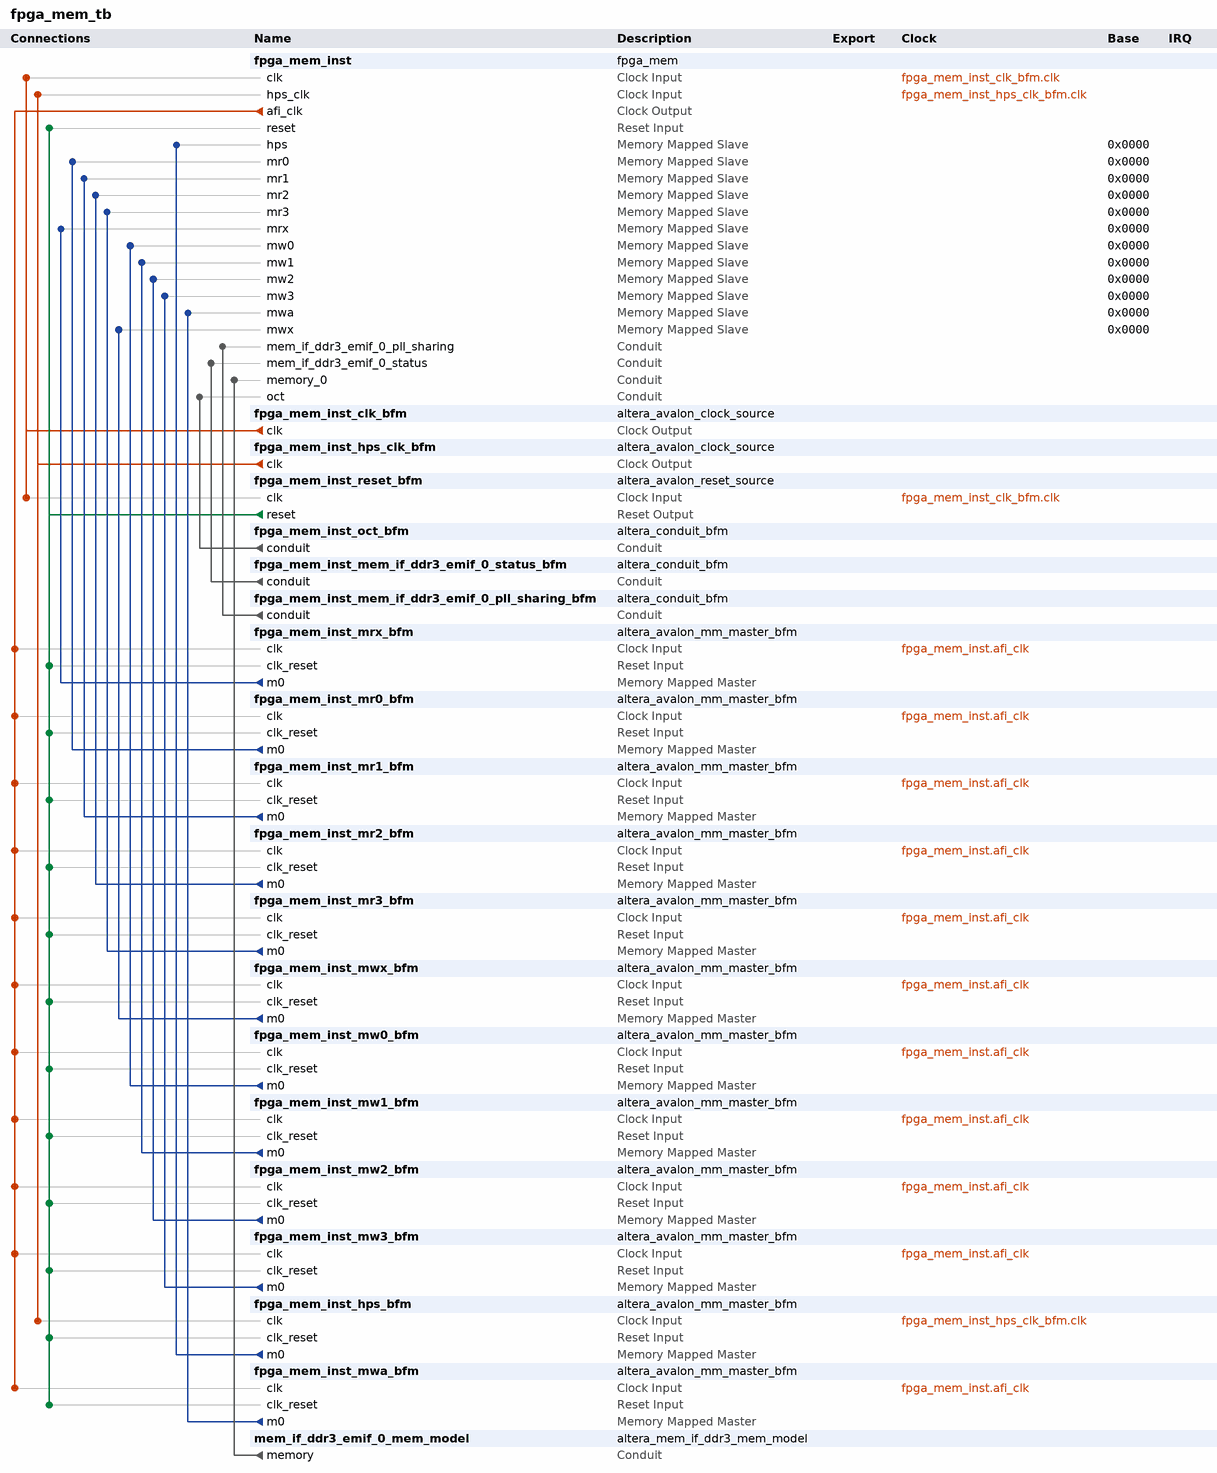
[diagram p0: system contents]
# Platform Designer (Qsys) system fpga_mem_tb, Cyclone V 5CSXFC6D6F31C6
# Parameters at their usual value, and those the tool derives, are not listed.
package require -exact qsys 13.1
create_system fpga_mem_tb
set_project_property DEVICE_FAMILY {Cyclone V}
set_project_property DEVICE 5CSXFC6D6F31C6

add_instance fpga_mem_inst fpga_mem 1.0

add_instance fpga_mem_inst_clk_bfm altera_avalon_clock_source 13.1

add_instance fpga_mem_inst_hps_clk_bfm altera_avalon_clock_source 13.1

add_instance fpga_mem_inst_reset_bfm altera_avalon_reset_source 13.1
set_instance_parameter_value fpga_mem_inst_reset_bfm ASSERT_HIGH_RESET 0
set_instance_parameter_value fpga_mem_inst_reset_bfm INITIAL_RESET_CYCLES 50

add_instance fpga_mem_inst_oct_bfm altera_conduit_bfm 13.1
set_instance_parameter_value fpga_mem_inst_oct_bfm CLOCKED_SIGNAL false
set_instance_parameter_value fpga_mem_inst_oct_bfm ENABLE_RESET false
set_instance_parameter_value fpga_mem_inst_oct_bfm SIGNAL_ROLES rzqin
set_instance_parameter_value fpga_mem_inst_oct_bfm SIGNAL_WIDTHS 1
set_instance_parameter_value fpga_mem_inst_oct_bfm SIGNAL_DIRECTIONS output

add_instance fpga_mem_inst_mem_if_ddr3_emif_0_status_bfm altera_conduit_bfm 13.1
set_instance_parameter_value fpga_mem_inst_mem_if_ddr3_emif_0_status_bfm CLOCKED_SIGNAL false
set_instance_parameter_value fpga_mem_inst_mem_if_ddr3_emif_0_status_bfm ENABLE_RESET false
set_instance_parameter_value fpga_mem_inst_mem_if_ddr3_emif_0_status_bfm SIGNAL_ROLES local_init_done,local_cal_success,local_cal_fail
set_instance_parameter_value fpga_mem_inst_mem_if_ddr3_emif_0_status_bfm SIGNAL_WIDTHS 1,1,1
set_instance_parameter_value fpga_mem_inst_mem_if_ddr3_emif_0_status_bfm SIGNAL_DIRECTIONS input,input,input

add_instance fpga_mem_inst_mem_if_ddr3_emif_0_pll_sharing_bfm altera_conduit_bfm 13.1
set_instance_parameter_value fpga_mem_inst_mem_if_ddr3_emif_0_pll_sharing_bfm CLOCKED_SIGNAL false
set_instance_parameter_value fpga_mem_inst_mem_if_ddr3_emif_0_pll_sharing_bfm ENABLE_RESET false
set_instance_parameter_value fpga_mem_inst_mem_if_ddr3_emif_0_pll_sharing_bfm SIGNAL_ROLES pll_mem_clk,pll_write_clk,pll_locked,pll_write_clk_pre_phy_clk,pll_addr_cmd_clk,pll_avl_clk,pll_config_clk,pll_dr_clk,pll_dr_clk_pre_phy_clk,pll_mem_phy_clk,afi_phy_clk,pll_avl_phy_clk
set_instance_parameter_value fpga_mem_inst_mem_if_ddr3_emif_0_pll_sharing_bfm SIGNAL_WIDTHS 1,1,1,1,1,1,1,1,1,1,1,1
set_instance_parameter_value fpga_mem_inst_mem_if_ddr3_emif_0_pll_sharing_bfm SIGNAL_DIRECTIONS input,input,input,input,input,input,input,input,input,input,input,input

add_instance fpga_mem_inst_mrx_bfm altera_avalon_mm_master_bfm 13.1
set_instance_parameter_value fpga_mem_inst_mrx_bfm AV_ADDRESS_W 26
set_instance_parameter_value fpga_mem_inst_mrx_bfm AV_NUMSYMBOLS 16
set_instance_parameter_value fpga_mem_inst_mrx_bfm AV_BURSTCOUNT_W 6
set_instance_parameter_value fpga_mem_inst_mrx_bfm AV_READRESPONSE_W 1
set_instance_parameter_value fpga_mem_inst_mrx_bfm AV_WRITERESPONSE_W 1
set_instance_parameter_value fpga_mem_inst_mrx_bfm USE_READ 1
set_instance_parameter_value fpga_mem_inst_mrx_bfm USE_BYTE_ENABLE 1
set_instance_parameter_value fpga_mem_inst_mrx_bfm USE_BURSTCOUNT 1
set_instance_parameter_value fpga_mem_inst_mrx_bfm USE_READ_DATA 1
set_instance_parameter_value fpga_mem_inst_mrx_bfm USE_READ_DATA_VALID 1
set_instance_parameter_value fpga_mem_inst_mrx_bfm USE_DEBUGACCESS 1
set_instance_parameter_value fpga_mem_inst_mrx_bfm USE_WAIT_REQUEST 1
set_instance_parameter_value fpga_mem_inst_mrx_bfm AV_CONSTANT_BURST_BEHAVIOR 1
set_instance_parameter_value fpga_mem_inst_mrx_bfm AV_BURST_LINEWRAP 0
set_instance_parameter_value fpga_mem_inst_mrx_bfm AV_BURST_BNDR_ONLY 0
set_instance_parameter_value fpga_mem_inst_mrx_bfm AV_MAX_PENDING_READS 4
set_instance_parameter_value fpga_mem_inst_mrx_bfm AV_MAX_PENDING_WRITES 0
set_instance_parameter_value fpga_mem_inst_mrx_bfm AV_FIX_READ_LATENCY 0
set_instance_parameter_value fpga_mem_inst_mrx_bfm AV_READ_WAIT_TIME 0
set_instance_parameter_value fpga_mem_inst_mrx_bfm ADDRESS_UNITS WORDS
set_instance_parameter_value fpga_mem_inst_mrx_bfm VHDL_ID 0

add_instance fpga_mem_inst_mr0_bfm altera_avalon_mm_master_bfm 13.1
set_instance_parameter_value fpga_mem_inst_mr0_bfm AV_ADDRESS_W 26
set_instance_parameter_value fpga_mem_inst_mr0_bfm AV_NUMSYMBOLS 16
set_instance_parameter_value fpga_mem_inst_mr0_bfm AV_BURSTCOUNT_W 6
set_instance_parameter_value fpga_mem_inst_mr0_bfm AV_READRESPONSE_W 1
set_instance_parameter_value fpga_mem_inst_mr0_bfm AV_WRITERESPONSE_W 1
set_instance_parameter_value fpga_mem_inst_mr0_bfm USE_READ 1
set_instance_parameter_value fpga_mem_inst_mr0_bfm USE_BYTE_ENABLE 1
set_instance_parameter_value fpga_mem_inst_mr0_bfm USE_BURSTCOUNT 1
set_instance_parameter_value fpga_mem_inst_mr0_bfm USE_READ_DATA 1
set_instance_parameter_value fpga_mem_inst_mr0_bfm USE_READ_DATA_VALID 1
set_instance_parameter_value fpga_mem_inst_mr0_bfm USE_DEBUGACCESS 1
set_instance_parameter_value fpga_mem_inst_mr0_bfm USE_WAIT_REQUEST 1
set_instance_parameter_value fpga_mem_inst_mr0_bfm AV_CONSTANT_BURST_BEHAVIOR 1
set_instance_parameter_value fpga_mem_inst_mr0_bfm AV_BURST_LINEWRAP 0
set_instance_parameter_value fpga_mem_inst_mr0_bfm AV_BURST_BNDR_ONLY 0
set_instance_parameter_value fpga_mem_inst_mr0_bfm AV_MAX_PENDING_READS 4
set_instance_parameter_value fpga_mem_inst_mr0_bfm AV_MAX_PENDING_WRITES 0
set_instance_parameter_value fpga_mem_inst_mr0_bfm AV_FIX_READ_LATENCY 0
set_instance_parameter_value fpga_mem_inst_mr0_bfm AV_READ_WAIT_TIME 0
set_instance_parameter_value fpga_mem_inst_mr0_bfm ADDRESS_UNITS WORDS
set_instance_parameter_value fpga_mem_inst_mr0_bfm VHDL_ID 1

add_instance fpga_mem_inst_mr1_bfm altera_avalon_mm_master_bfm 13.1
set_instance_parameter_value fpga_mem_inst_mr1_bfm AV_ADDRESS_W 26
set_instance_parameter_value fpga_mem_inst_mr1_bfm AV_NUMSYMBOLS 16
set_instance_parameter_value fpga_mem_inst_mr1_bfm AV_BURSTCOUNT_W 6
set_instance_parameter_value fpga_mem_inst_mr1_bfm AV_READRESPONSE_W 1
set_instance_parameter_value fpga_mem_inst_mr1_bfm AV_WRITERESPONSE_W 1
set_instance_parameter_value fpga_mem_inst_mr1_bfm USE_READ 1
set_instance_parameter_value fpga_mem_inst_mr1_bfm USE_BYTE_ENABLE 1
set_instance_parameter_value fpga_mem_inst_mr1_bfm USE_BURSTCOUNT 1
set_instance_parameter_value fpga_mem_inst_mr1_bfm USE_READ_DATA 1
set_instance_parameter_value fpga_mem_inst_mr1_bfm USE_READ_DATA_VALID 1
set_instance_parameter_value fpga_mem_inst_mr1_bfm USE_DEBUGACCESS 1
set_instance_parameter_value fpga_mem_inst_mr1_bfm USE_WAIT_REQUEST 1
set_instance_parameter_value fpga_mem_inst_mr1_bfm AV_CONSTANT_BURST_BEHAVIOR 1
set_instance_parameter_value fpga_mem_inst_mr1_bfm AV_BURST_LINEWRAP 0
set_instance_parameter_value fpga_mem_inst_mr1_bfm AV_BURST_BNDR_ONLY 0
set_instance_parameter_value fpga_mem_inst_mr1_bfm AV_MAX_PENDING_READS 4
set_instance_parameter_value fpga_mem_inst_mr1_bfm AV_MAX_PENDING_WRITES 0
set_instance_parameter_value fpga_mem_inst_mr1_bfm AV_FIX_READ_LATENCY 0
set_instance_parameter_value fpga_mem_inst_mr1_bfm AV_READ_WAIT_TIME 0
set_instance_parameter_value fpga_mem_inst_mr1_bfm ADDRESS_UNITS WORDS
set_instance_parameter_value fpga_mem_inst_mr1_bfm VHDL_ID 2

add_instance fpga_mem_inst_mr2_bfm altera_avalon_mm_master_bfm 13.1
set_instance_parameter_value fpga_mem_inst_mr2_bfm AV_ADDRESS_W 26
set_instance_parameter_value fpga_mem_inst_mr2_bfm AV_NUMSYMBOLS 16
set_instance_parameter_value fpga_mem_inst_mr2_bfm AV_BURSTCOUNT_W 6
set_instance_parameter_value fpga_mem_inst_mr2_bfm AV_READRESPONSE_W 1
set_instance_parameter_value fpga_mem_inst_mr2_bfm AV_WRITERESPONSE_W 1
set_instance_parameter_value fpga_mem_inst_mr2_bfm USE_READ 1
set_instance_parameter_value fpga_mem_inst_mr2_bfm USE_BYTE_ENABLE 1
set_instance_parameter_value fpga_mem_inst_mr2_bfm USE_BURSTCOUNT 1
set_instance_parameter_value fpga_mem_inst_mr2_bfm USE_READ_DATA 1
set_instance_parameter_value fpga_mem_inst_mr2_bfm USE_READ_DATA_VALID 1
set_instance_parameter_value fpga_mem_inst_mr2_bfm USE_DEBUGACCESS 1
set_instance_parameter_value fpga_mem_inst_mr2_bfm USE_WAIT_REQUEST 1
set_instance_parameter_value fpga_mem_inst_mr2_bfm AV_CONSTANT_BURST_BEHAVIOR 1
set_instance_parameter_value fpga_mem_inst_mr2_bfm AV_BURST_LINEWRAP 0
set_instance_parameter_value fpga_mem_inst_mr2_bfm AV_BURST_BNDR_ONLY 0
set_instance_parameter_value fpga_mem_inst_mr2_bfm AV_MAX_PENDING_READS 4
set_instance_parameter_value fpga_mem_inst_mr2_bfm AV_MAX_PENDING_WRITES 0
set_instance_parameter_value fpga_mem_inst_mr2_bfm AV_FIX_READ_LATENCY 0
set_instance_parameter_value fpga_mem_inst_mr2_bfm AV_READ_WAIT_TIME 0
set_instance_parameter_value fpga_mem_inst_mr2_bfm ADDRESS_UNITS WORDS
set_instance_parameter_value fpga_mem_inst_mr2_bfm VHDL_ID 3

add_instance fpga_mem_inst_mr3_bfm altera_avalon_mm_master_bfm 13.1
set_instance_parameter_value fpga_mem_inst_mr3_bfm AV_ADDRESS_W 26
set_instance_parameter_value fpga_mem_inst_mr3_bfm AV_NUMSYMBOLS 16
set_instance_parameter_value fpga_mem_inst_mr3_bfm AV_BURSTCOUNT_W 6
set_instance_parameter_value fpga_mem_inst_mr3_bfm AV_READRESPONSE_W 1
set_instance_parameter_value fpga_mem_inst_mr3_bfm AV_WRITERESPONSE_W 1
set_instance_parameter_value fpga_mem_inst_mr3_bfm USE_READ 1
set_instance_parameter_value fpga_mem_inst_mr3_bfm USE_BYTE_ENABLE 1
set_instance_parameter_value fpga_mem_inst_mr3_bfm USE_BURSTCOUNT 1
set_instance_parameter_value fpga_mem_inst_mr3_bfm USE_READ_DATA 1
set_instance_parameter_value fpga_mem_inst_mr3_bfm USE_READ_DATA_VALID 1
set_instance_parameter_value fpga_mem_inst_mr3_bfm USE_DEBUGACCESS 1
set_instance_parameter_value fpga_mem_inst_mr3_bfm USE_WAIT_REQUEST 1
set_instance_parameter_value fpga_mem_inst_mr3_bfm AV_CONSTANT_BURST_BEHAVIOR 1
set_instance_parameter_value fpga_mem_inst_mr3_bfm AV_BURST_LINEWRAP 0
set_instance_parameter_value fpga_mem_inst_mr3_bfm AV_BURST_BNDR_ONLY 0
set_instance_parameter_value fpga_mem_inst_mr3_bfm AV_MAX_PENDING_READS 4
set_instance_parameter_value fpga_mem_inst_mr3_bfm AV_MAX_PENDING_WRITES 0
set_instance_parameter_value fpga_mem_inst_mr3_bfm AV_FIX_READ_LATENCY 0
set_instance_parameter_value fpga_mem_inst_mr3_bfm AV_READ_WAIT_TIME 0
set_instance_parameter_value fpga_mem_inst_mr3_bfm ADDRESS_UNITS WORDS
set_instance_parameter_value fpga_mem_inst_mr3_bfm VHDL_ID 4

add_instance fpga_mem_inst_mwx_bfm altera_avalon_mm_master_bfm 13.1
set_instance_parameter_value fpga_mem_inst_mwx_bfm AV_ADDRESS_W 26
set_instance_parameter_value fpga_mem_inst_mwx_bfm AV_NUMSYMBOLS 16
set_instance_parameter_value fpga_mem_inst_mwx_bfm AV_BURSTCOUNT_W 6
set_instance_parameter_value fpga_mem_inst_mwx_bfm AV_READRESPONSE_W 1
set_instance_parameter_value fpga_mem_inst_mwx_bfm AV_WRITERESPONSE_W 1
set_instance_parameter_value fpga_mem_inst_mwx_bfm USE_READ 1
set_instance_parameter_value fpga_mem_inst_mwx_bfm USE_BYTE_ENABLE 1
set_instance_parameter_value fpga_mem_inst_mwx_bfm USE_BURSTCOUNT 1
set_instance_parameter_value fpga_mem_inst_mwx_bfm USE_READ_DATA 1
set_instance_parameter_value fpga_mem_inst_mwx_bfm USE_READ_DATA_VALID 1
set_instance_parameter_value fpga_mem_inst_mwx_bfm USE_DEBUGACCESS 1
set_instance_parameter_value fpga_mem_inst_mwx_bfm USE_WAIT_REQUEST 1
set_instance_parameter_value fpga_mem_inst_mwx_bfm AV_CONSTANT_BURST_BEHAVIOR 1
set_instance_parameter_value fpga_mem_inst_mwx_bfm AV_BURST_LINEWRAP 0
set_instance_parameter_value fpga_mem_inst_mwx_bfm AV_BURST_BNDR_ONLY 0
set_instance_parameter_value fpga_mem_inst_mwx_bfm AV_MAX_PENDING_READS 4
set_instance_parameter_value fpga_mem_inst_mwx_bfm AV_MAX_PENDING_WRITES 0
set_instance_parameter_value fpga_mem_inst_mwx_bfm AV_FIX_READ_LATENCY 0
set_instance_parameter_value fpga_mem_inst_mwx_bfm AV_READ_WAIT_TIME 0
set_instance_parameter_value fpga_mem_inst_mwx_bfm ADDRESS_UNITS WORDS
set_instance_parameter_value fpga_mem_inst_mwx_bfm VHDL_ID 5

add_instance fpga_mem_inst_mw0_bfm altera_avalon_mm_master_bfm 13.1
set_instance_parameter_value fpga_mem_inst_mw0_bfm AV_ADDRESS_W 26
set_instance_parameter_value fpga_mem_inst_mw0_bfm AV_NUMSYMBOLS 16
set_instance_parameter_value fpga_mem_inst_mw0_bfm AV_BURSTCOUNT_W 6
set_instance_parameter_value fpga_mem_inst_mw0_bfm AV_READRESPONSE_W 1
set_instance_parameter_value fpga_mem_inst_mw0_bfm AV_WRITERESPONSE_W 1
set_instance_parameter_value fpga_mem_inst_mw0_bfm USE_READ 1
set_instance_parameter_value fpga_mem_inst_mw0_bfm USE_BYTE_ENABLE 1
set_instance_parameter_value fpga_mem_inst_mw0_bfm USE_BURSTCOUNT 1
set_instance_parameter_value fpga_mem_inst_mw0_bfm USE_READ_DATA 1
set_instance_parameter_value fpga_mem_inst_mw0_bfm USE_READ_DATA_VALID 1
set_instance_parameter_value fpga_mem_inst_mw0_bfm USE_DEBUGACCESS 1
set_instance_parameter_value fpga_mem_inst_mw0_bfm USE_WAIT_REQUEST 1
set_instance_parameter_value fpga_mem_inst_mw0_bfm AV_CONSTANT_BURST_BEHAVIOR 1
set_instance_parameter_value fpga_mem_inst_mw0_bfm AV_BURST_LINEWRAP 0
set_instance_parameter_value fpga_mem_inst_mw0_bfm AV_BURST_BNDR_ONLY 0
set_instance_parameter_value fpga_mem_inst_mw0_bfm AV_MAX_PENDING_READS 4
set_instance_parameter_value fpga_mem_inst_mw0_bfm AV_MAX_PENDING_WRITES 0
set_instance_parameter_value fpga_mem_inst_mw0_bfm AV_FIX_READ_LATENCY 0
set_instance_parameter_value fpga_mem_inst_mw0_bfm AV_READ_WAIT_TIME 0
set_instance_parameter_value fpga_mem_inst_mw0_bfm ADDRESS_UNITS WORDS
set_instance_parameter_value fpga_mem_inst_mw0_bfm VHDL_ID 6

add_instance fpga_mem_inst_mw1_bfm altera_avalon_mm_master_bfm 13.1
set_instance_parameter_value fpga_mem_inst_mw1_bfm AV_ADDRESS_W 26
set_instance_parameter_value fpga_mem_inst_mw1_bfm AV_NUMSYMBOLS 16
set_instance_parameter_value fpga_mem_inst_mw1_bfm AV_BURSTCOUNT_W 6
set_instance_parameter_value fpga_mem_inst_mw1_bfm AV_READRESPONSE_W 1
set_instance_parameter_value fpga_mem_inst_mw1_bfm AV_WRITERESPONSE_W 1
set_instance_parameter_value fpga_mem_inst_mw1_bfm USE_READ 1
set_instance_parameter_value fpga_mem_inst_mw1_bfm USE_BYTE_ENABLE 1
set_instance_parameter_value fpga_mem_inst_mw1_bfm USE_BURSTCOUNT 1
set_instance_parameter_value fpga_mem_inst_mw1_bfm USE_READ_DATA 1
set_instance_parameter_value fpga_mem_inst_mw1_bfm USE_READ_DATA_VALID 1
set_instance_parameter_value fpga_mem_inst_mw1_bfm USE_DEBUGACCESS 1
set_instance_parameter_value fpga_mem_inst_mw1_bfm USE_WAIT_REQUEST 1
set_instance_parameter_value fpga_mem_inst_mw1_bfm AV_CONSTANT_BURST_BEHAVIOR 1
set_instance_parameter_value fpga_mem_inst_mw1_bfm AV_BURST_LINEWRAP 0
set_instance_parameter_value fpga_mem_inst_mw1_bfm AV_BURST_BNDR_ONLY 0
set_instance_parameter_value fpga_mem_inst_mw1_bfm AV_MAX_PENDING_READS 4
set_instance_parameter_value fpga_mem_inst_mw1_bfm AV_MAX_PENDING_WRITES 0
set_instance_parameter_value fpga_mem_inst_mw1_bfm AV_FIX_READ_LATENCY 0
set_instance_parameter_value fpga_mem_inst_mw1_bfm AV_READ_WAIT_TIME 0
set_instance_parameter_value fpga_mem_inst_mw1_bfm ADDRESS_UNITS WORDS
set_instance_parameter_value fpga_mem_inst_mw1_bfm VHDL_ID 7

add_instance fpga_mem_inst_mw2_bfm altera_avalon_mm_master_bfm 13.1
set_instance_parameter_value fpga_mem_inst_mw2_bfm AV_ADDRESS_W 26
set_instance_parameter_value fpga_mem_inst_mw2_bfm AV_NUMSYMBOLS 16
set_instance_parameter_value fpga_mem_inst_mw2_bfm AV_BURSTCOUNT_W 6
set_instance_parameter_value fpga_mem_inst_mw2_bfm AV_READRESPONSE_W 1
set_instance_parameter_value fpga_mem_inst_mw2_bfm AV_WRITERESPONSE_W 1
set_instance_parameter_value fpga_mem_inst_mw2_bfm USE_READ 1
set_instance_parameter_value fpga_mem_inst_mw2_bfm USE_BYTE_ENABLE 1
set_instance_parameter_value fpga_mem_inst_mw2_bfm USE_BURSTCOUNT 1
set_instance_parameter_value fpga_mem_inst_mw2_bfm USE_READ_DATA 1
set_instance_parameter_value fpga_mem_inst_mw2_bfm USE_READ_DATA_VALID 1
set_instance_parameter_value fpga_mem_inst_mw2_bfm USE_DEBUGACCESS 1
set_instance_parameter_value fpga_mem_inst_mw2_bfm USE_WAIT_REQUEST 1
set_instance_parameter_value fpga_mem_inst_mw2_bfm AV_CONSTANT_BURST_BEHAVIOR 1
set_instance_parameter_value fpga_mem_inst_mw2_bfm AV_BURST_LINEWRAP 0
set_instance_parameter_value fpga_mem_inst_mw2_bfm AV_BURST_BNDR_ONLY 0
set_instance_parameter_value fpga_mem_inst_mw2_bfm AV_MAX_PENDING_READS 4
set_instance_parameter_value fpga_mem_inst_mw2_bfm AV_MAX_PENDING_WRITES 0
set_instance_parameter_value fpga_mem_inst_mw2_bfm AV_FIX_READ_LATENCY 0
set_instance_parameter_value fpga_mem_inst_mw2_bfm AV_READ_WAIT_TIME 0
set_instance_parameter_value fpga_mem_inst_mw2_bfm ADDRESS_UNITS WORDS
set_instance_parameter_value fpga_mem_inst_mw2_bfm VHDL_ID 8

add_instance fpga_mem_inst_mw3_bfm altera_avalon_mm_master_bfm 13.1
set_instance_parameter_value fpga_mem_inst_mw3_bfm AV_ADDRESS_W 26
set_instance_parameter_value fpga_mem_inst_mw3_bfm AV_NUMSYMBOLS 16
set_instance_parameter_value fpga_mem_inst_mw3_bfm AV_BURSTCOUNT_W 6
set_instance_parameter_value fpga_mem_inst_mw3_bfm AV_READRESPONSE_W 1
set_instance_parameter_value fpga_mem_inst_mw3_bfm AV_WRITERESPONSE_W 1
set_instance_parameter_value fpga_mem_inst_mw3_bfm USE_READ 1
set_instance_parameter_value fpga_mem_inst_mw3_bfm USE_BYTE_ENABLE 1
set_instance_parameter_value fpga_mem_inst_mw3_bfm USE_BURSTCOUNT 1
set_instance_parameter_value fpga_mem_inst_mw3_bfm USE_READ_DATA 1
set_instance_parameter_value fpga_mem_inst_mw3_bfm USE_READ_DATA_VALID 1
set_instance_parameter_value fpga_mem_inst_mw3_bfm USE_DEBUGACCESS 1
set_instance_parameter_value fpga_mem_inst_mw3_bfm USE_WAIT_REQUEST 1
set_instance_parameter_value fpga_mem_inst_mw3_bfm AV_CONSTANT_BURST_BEHAVIOR 1
set_instance_parameter_value fpga_mem_inst_mw3_bfm AV_BURST_LINEWRAP 0
set_instance_parameter_value fpga_mem_inst_mw3_bfm AV_BURST_BNDR_ONLY 0
set_instance_parameter_value fpga_mem_inst_mw3_bfm AV_MAX_PENDING_READS 4
set_instance_parameter_value fpga_mem_inst_mw3_bfm AV_MAX_PENDING_WRITES 0
set_instance_parameter_value fpga_mem_inst_mw3_bfm AV_FIX_READ_LATENCY 0
set_instance_parameter_value fpga_mem_inst_mw3_bfm AV_READ_WAIT_TIME 0
set_instance_parameter_value fpga_mem_inst_mw3_bfm ADDRESS_UNITS WORDS
set_instance_parameter_value fpga_mem_inst_mw3_bfm VHDL_ID 9

add_instance fpga_mem_inst_hps_bfm altera_avalon_mm_master_bfm 13.1
set_instance_parameter_value fpga_mem_inst_hps_bfm AV_ADDRESS_W 26
set_instance_parameter_value fpga_mem_inst_hps_bfm AV_NUMSYMBOLS 16
set_instance_parameter_value fpga_mem_inst_hps_bfm AV_BURSTCOUNT_W 6
set_instance_parameter_value fpga_mem_inst_hps_bfm AV_READRESPONSE_W 1
set_instance_parameter_value fpga_mem_inst_hps_bfm AV_WRITERESPONSE_W 1
set_instance_parameter_value fpga_mem_inst_hps_bfm USE_READ 1
set_instance_parameter_value fpga_mem_inst_hps_bfm USE_BYTE_ENABLE 1
set_instance_parameter_value fpga_mem_inst_hps_bfm USE_BURSTCOUNT 1
set_instance_parameter_value fpga_mem_inst_hps_bfm USE_READ_DATA 1
set_instance_parameter_value fpga_mem_inst_hps_bfm USE_READ_DATA_VALID 1
set_instance_parameter_value fpga_mem_inst_hps_bfm USE_DEBUGACCESS 1
set_instance_parameter_value fpga_mem_inst_hps_bfm USE_WAIT_REQUEST 1
set_instance_parameter_value fpga_mem_inst_hps_bfm AV_CONSTANT_BURST_BEHAVIOR 1
set_instance_parameter_value fpga_mem_inst_hps_bfm AV_BURST_LINEWRAP 0
set_instance_parameter_value fpga_mem_inst_hps_bfm AV_BURST_BNDR_ONLY 0
set_instance_parameter_value fpga_mem_inst_hps_bfm AV_MAX_PENDING_READS 4
set_instance_parameter_value fpga_mem_inst_hps_bfm AV_MAX_PENDING_WRITES 0
set_instance_parameter_value fpga_mem_inst_hps_bfm AV_FIX_READ_LATENCY 0
set_instance_parameter_value fpga_mem_inst_hps_bfm AV_READ_WAIT_TIME 0
set_instance_parameter_value fpga_mem_inst_hps_bfm ADDRESS_UNITS WORDS
set_instance_parameter_value fpga_mem_inst_hps_bfm VHDL_ID 10

add_instance fpga_mem_inst_mwa_bfm altera_avalon_mm_master_bfm 13.1
set_instance_parameter_value fpga_mem_inst_mwa_bfm AV_ADDRESS_W 26
set_instance_parameter_value fpga_mem_inst_mwa_bfm AV_NUMSYMBOLS 16
set_instance_parameter_value fpga_mem_inst_mwa_bfm AV_BURSTCOUNT_W 6
set_instance_parameter_value fpga_mem_inst_mwa_bfm AV_READRESPONSE_W 1
set_instance_parameter_value fpga_mem_inst_mwa_bfm AV_WRITERESPONSE_W 1
set_instance_parameter_value fpga_mem_inst_mwa_bfm USE_READ 1
set_instance_parameter_value fpga_mem_inst_mwa_bfm USE_BYTE_ENABLE 1
set_instance_parameter_value fpga_mem_inst_mwa_bfm USE_BURSTCOUNT 1
set_instance_parameter_value fpga_mem_inst_mwa_bfm USE_READ_DATA 1
set_instance_parameter_value fpga_mem_inst_mwa_bfm USE_READ_DATA_VALID 1
set_instance_parameter_value fpga_mem_inst_mwa_bfm USE_DEBUGACCESS 1
set_instance_parameter_value fpga_mem_inst_mwa_bfm USE_WAIT_REQUEST 1
set_instance_parameter_value fpga_mem_inst_mwa_bfm AV_CONSTANT_BURST_BEHAVIOR 1
set_instance_parameter_value fpga_mem_inst_mwa_bfm AV_BURST_LINEWRAP 0
set_instance_parameter_value fpga_mem_inst_mwa_bfm AV_BURST_BNDR_ONLY 0
set_instance_parameter_value fpga_mem_inst_mwa_bfm AV_MAX_PENDING_READS 4
set_instance_parameter_value fpga_mem_inst_mwa_bfm AV_MAX_PENDING_WRITES 0
set_instance_parameter_value fpga_mem_inst_mwa_bfm AV_FIX_READ_LATENCY 0
set_instance_parameter_value fpga_mem_inst_mwa_bfm AV_READ_WAIT_TIME 0
set_instance_parameter_value fpga_mem_inst_mwa_bfm ADDRESS_UNITS WORDS
set_instance_parameter_value fpga_mem_inst_mwa_bfm VHDL_ID 11

add_instance mem_if_ddr3_emif_0_mem_model altera_mem_if_ddr3_mem_model 13.1
set_instance_parameter_value mem_if_ddr3_emif_0_mem_model MEM_VENDOR JEDEC
set_instance_parameter_value mem_if_ddr3_emif_0_mem_model MEM_FORMAT DISCRETE
set_instance_parameter_value mem_if_ddr3_emif_0_mem_model RDIMM_CONFIG 0000000000000000
set_instance_parameter_value mem_if_ddr3_emif_0_mem_model LRDIMM_EXTENDED_CONFIG 0x000000000000000000
set_instance_parameter_value mem_if_ddr3_emif_0_mem_model DISCRETE_FLY_BY true
set_instance_parameter_value mem_if_ddr3_emif_0_mem_model DEVICE_DEPTH 1
set_instance_parameter_value mem_if_ddr3_emif_0_mem_model MEM_MIRROR_ADDRESSING 0
set_instance_parameter_value mem_if_ddr3_emif_0_mem_model MEM_CLK_FREQ_MAX 400.0
set_instance_parameter_value mem_if_ddr3_emif_0_mem_model MEM_ROW_ADDR_WIDTH 15
set_instance_parameter_value mem_if_ddr3_emif_0_mem_model MEM_COL_ADDR_WIDTH 10
set_instance_parameter_value mem_if_ddr3_emif_0_mem_model MEM_DQ_WIDTH 32
set_instance_parameter_value mem_if_ddr3_emif_0_mem_model MEM_DQ_PER_DQS 8
set_instance_parameter_value mem_if_ddr3_emif_0_mem_model MEM_BANKADDR_WIDTH 3
set_instance_parameter_value mem_if_ddr3_emif_0_mem_model MEM_IF_DM_PINS_EN true
set_instance_parameter_value mem_if_ddr3_emif_0_mem_model MEM_IF_DQSN_EN true
set_instance_parameter_value mem_if_ddr3_emif_0_mem_model MEM_NUMBER_OF_DIMMS 1
set_instance_parameter_value mem_if_ddr3_emif_0_mem_model MEM_NUMBER_OF_RANKS_PER_DIMM 1
set_instance_parameter_value mem_if_ddr3_emif_0_mem_model MEM_NUMBER_OF_RANKS_PER_DEVICE 1
set_instance_parameter_value mem_if_ddr3_emif_0_mem_model MEM_RANK_MULTIPLICATION_FACTOR 1
set_instance_parameter_value mem_if_ddr3_emif_0_mem_model MEM_CK_WIDTH 1
set_instance_parameter_value mem_if_ddr3_emif_0_mem_model MEM_CS_WIDTH 1
set_instance_parameter_value mem_if_ddr3_emif_0_mem_model MEM_CLK_EN_WIDTH 1
set_instance_parameter_value mem_if_ddr3_emif_0_mem_model ALTMEMPHY_COMPATIBLE_MODE false
set_instance_parameter_value mem_if_ddr3_emif_0_mem_model NEXTGEN true
set_instance_parameter_value mem_if_ddr3_emif_0_mem_model MEM_IF_BOARD_BASE_DELAY 10
set_instance_parameter_value mem_if_ddr3_emif_0_mem_model MEM_IF_SIM_VALID_WINDOW 0
set_instance_parameter_value mem_if_ddr3_emif_0_mem_model MEM_GUARANTEED_WRITE_INIT false
set_instance_parameter_value mem_if_ddr3_emif_0_mem_model MEM_VERBOSE true
set_instance_parameter_value mem_if_ddr3_emif_0_mem_model PINGPONGPHY_EN false
set_instance_parameter_value mem_if_ddr3_emif_0_mem_model REFRESH_BURST_VALIDATION false
set_instance_parameter_value mem_if_ddr3_emif_0_mem_model MEM_BL OTF
set_instance_parameter_value mem_if_ddr3_emif_0_mem_model MEM_BT Sequential
set_instance_parameter_value mem_if_ddr3_emif_0_mem_model MEM_ASR Manual
set_instance_parameter_value mem_if_ddr3_emif_0_mem_model MEM_SRT Normal
set_instance_parameter_value mem_if_ddr3_emif_0_mem_model MEM_PD {DLL off}
set_instance_parameter_value mem_if_ddr3_emif_0_mem_model MEM_DRV_STR RZQ/7
set_instance_parameter_value mem_if_ddr3_emif_0_mem_model MEM_DLL_EN true
set_instance_parameter_value mem_if_ddr3_emif_0_mem_model MEM_RTT_NOM RZQ/6
set_instance_parameter_value mem_if_ddr3_emif_0_mem_model MEM_RTT_WR RZQ/4
set_instance_parameter_value mem_if_ddr3_emif_0_mem_model MEM_WTCL 5
set_instance_parameter_value mem_if_ddr3_emif_0_mem_model MEM_ATCL Disabled
set_instance_parameter_value mem_if_ddr3_emif_0_mem_model MEM_TCL 6
set_instance_parameter_value mem_if_ddr3_emif_0_mem_model MEM_AUTO_LEVELING_MODE true
set_instance_parameter_value mem_if_ddr3_emif_0_mem_model MEM_USER_LEVELING_MODE Leveling
set_instance_parameter_value mem_if_ddr3_emif_0_mem_model MEM_INIT_EN false
set_instance_parameter_value mem_if_ddr3_emif_0_mem_model DAT_DATA_WIDTH 32
set_instance_parameter_value mem_if_ddr3_emif_0_mem_model TIMING_TIS 200
set_instance_parameter_value mem_if_ddr3_emif_0_mem_model TIMING_TIH 275
set_instance_parameter_value mem_if_ddr3_emif_0_mem_model TIMING_TDS 75
set_instance_parameter_value mem_if_ddr3_emif_0_mem_model TIMING_TDH 150
set_instance_parameter_value mem_if_ddr3_emif_0_mem_model TIMING_TDQSQ 200
set_instance_parameter_value mem_if_ddr3_emif_0_mem_model TIMING_TQH 0.38
set_instance_parameter_value mem_if_ddr3_emif_0_mem_model TIMING_TDQSCK 400
set_instance_parameter_value mem_if_ddr3_emif_0_mem_model TIMING_TDQSCKDS 450
set_instance_parameter_value mem_if_ddr3_emif_0_mem_model TIMING_TDQSCKDM 900
set_instance_parameter_value mem_if_ddr3_emif_0_mem_model TIMING_TDQSCKDL 1200
set_instance_parameter_value mem_if_ddr3_emif_0_mem_model TIMING_TDQSS 0.25
set_instance_parameter_value mem_if_ddr3_emif_0_mem_model TIMING_TQSH 0.38
set_instance_parameter_value mem_if_ddr3_emif_0_mem_model TIMING_TDSH 0.2
set_instance_parameter_value mem_if_ddr3_emif_0_mem_model TIMING_TDSS 0.2
set_instance_parameter_value mem_if_ddr3_emif_0_mem_model MEM_TINIT_US 500
set_instance_parameter_value mem_if_ddr3_emif_0_mem_model MEM_TMRD_CK 4
set_instance_parameter_value mem_if_ddr3_emif_0_mem_model MEM_TRAS_NS 37.5
set_instance_parameter_value mem_if_ddr3_emif_0_mem_model MEM_TRCD_NS 15.0
set_instance_parameter_value mem_if_ddr3_emif_0_mem_model MEM_TRP_NS 15.0
set_instance_parameter_value mem_if_ddr3_emif_0_mem_model MEM_TREFI_US 7.8
set_instance_parameter_value mem_if_ddr3_emif_0_mem_model MEM_TRFC_NS 300.0
set_instance_parameter_value mem_if_ddr3_emif_0_mem_model CFG_TCCD_NS 2.5
set_instance_parameter_value mem_if_ddr3_emif_0_mem_model MEM_TWR_NS 15.0
set_instance_parameter_value mem_if_ddr3_emif_0_mem_model MEM_TWTR 4
set_instance_parameter_value mem_if_ddr3_emif_0_mem_model MEM_TFAW_NS 50.0
set_instance_parameter_value mem_if_ddr3_emif_0_mem_model MEM_TRRD_NS 13.2
set_instance_parameter_value mem_if_ddr3_emif_0_mem_model MEM_TRTP_NS 13.2
set_instance_parameter_value mem_if_ddr3_emif_0_mem_model RATE Full
set_instance_parameter_value mem_if_ddr3_emif_0_mem_model MEM_CLK_FREQ 400.0
set_instance_parameter_value mem_if_ddr3_emif_0_mem_model USE_MEM_CLK_FREQ false
set_instance_parameter_value mem_if_ddr3_emif_0_mem_model FORCE_DQS_TRACKING AUTO
set_instance_parameter_value mem_if_ddr3_emif_0_mem_model FORCE_SHADOW_REGS AUTO
set_instance_parameter_value mem_if_ddr3_emif_0_mem_model MRS_MIRROR_PING_PONG_ATSO false
set_instance_parameter_value mem_if_ddr3_emif_0_mem_model PARSE_FRIENDLY_DEVICE_FAMILY_PARAM_VALID false
set_instance_parameter_value mem_if_ddr3_emif_0_mem_model SPEED_GRADE 6
set_instance_parameter_value mem_if_ddr3_emif_0_mem_model IS_ES_DEVICE false
set_instance_parameter_value mem_if_ddr3_emif_0_mem_model DISABLE_CHILD_MESSAGING false
set_instance_parameter_value mem_if_ddr3_emif_0_mem_model HARD_EMIF true
set_instance_parameter_value mem_if_ddr3_emif_0_mem_model HHP_HPS false
set_instance_parameter_value mem_if_ddr3_emif_0_mem_model HHP_HPS_VERIFICATION false
set_instance_parameter_value mem_if_ddr3_emif_0_mem_model HHP_HPS_SIMULATION false
set_instance_parameter_value mem_if_ddr3_emif_0_mem_model HPS_PROTOCOL DEFAULT
set_instance_parameter_value mem_if_ddr3_emif_0_mem_model CUT_NEW_FAMILY_TIMING true

# connections
add_connection fpga_mem_inst.afi_clk fpga_mem_inst_mr0_bfm.clk clock
add_connection fpga_mem_inst.afi_clk fpga_mem_inst_mr1_bfm.clk clock
add_connection fpga_mem_inst.afi_clk fpga_mem_inst_mr2_bfm.clk clock
add_connection fpga_mem_inst.afi_clk fpga_mem_inst_mr3_bfm.clk clock
add_connection fpga_mem_inst.afi_clk fpga_mem_inst_mrx_bfm.clk clock
add_connection fpga_mem_inst.afi_clk fpga_mem_inst_mw0_bfm.clk clock
add_connection fpga_mem_inst.afi_clk fpga_mem_inst_mw1_bfm.clk clock
add_connection fpga_mem_inst.afi_clk fpga_mem_inst_mw2_bfm.clk clock
add_connection fpga_mem_inst.afi_clk fpga_mem_inst_mw3_bfm.clk clock
add_connection fpga_mem_inst.afi_clk fpga_mem_inst_mwa_bfm.clk clock
add_connection fpga_mem_inst.afi_clk fpga_mem_inst_mwx_bfm.clk clock
add_connection fpga_mem_inst_clk_bfm.clk fpga_mem_inst.clk clock
add_connection fpga_mem_inst_clk_bfm.clk fpga_mem_inst_reset_bfm.clk clock
add_connection fpga_mem_inst_hps_clk_bfm.clk fpga_mem_inst.hps_clk clock
add_connection fpga_mem_inst_hps_clk_bfm.clk fpga_mem_inst_hps_bfm.clk clock
add_connection fpga_mem_inst_reset_bfm.reset fpga_mem_inst.reset reset
add_connection fpga_mem_inst_reset_bfm.reset fpga_mem_inst_hps_bfm.clk_reset reset
add_connection fpga_mem_inst_reset_bfm.reset fpga_mem_inst_mr0_bfm.clk_reset reset
add_connection fpga_mem_inst_reset_bfm.reset fpga_mem_inst_mr1_bfm.clk_reset reset
add_connection fpga_mem_inst_reset_bfm.reset fpga_mem_inst_mr2_bfm.clk_reset reset
add_connection fpga_mem_inst_reset_bfm.reset fpga_mem_inst_mr3_bfm.clk_reset reset
add_connection fpga_mem_inst_reset_bfm.reset fpga_mem_inst_mrx_bfm.clk_reset reset
add_connection fpga_mem_inst_reset_bfm.reset fpga_mem_inst_mw0_bfm.clk_reset reset
add_connection fpga_mem_inst_reset_bfm.reset fpga_mem_inst_mw1_bfm.clk_reset reset
add_connection fpga_mem_inst_reset_bfm.reset fpga_mem_inst_mw2_bfm.clk_reset reset
add_connection fpga_mem_inst_reset_bfm.reset fpga_mem_inst_mw3_bfm.clk_reset reset
add_connection fpga_mem_inst_reset_bfm.reset fpga_mem_inst_mwa_bfm.clk_reset reset
add_connection fpga_mem_inst_reset_bfm.reset fpga_mem_inst_mwx_bfm.clk_reset reset
add_connection fpga_mem_inst_hps_bfm.m0 fpga_mem_inst.hps avalon
set_connection_parameter_value fpga_mem_inst_hps_bfm.m0/fpga_mem_inst.hps baseAddress 0x0000
add_connection fpga_mem_inst_mr0_bfm.m0 fpga_mem_inst.mr0 avalon
set_connection_parameter_value fpga_mem_inst_mr0_bfm.m0/fpga_mem_inst.mr0 baseAddress 0x0000
add_connection fpga_mem_inst_mr1_bfm.m0 fpga_mem_inst.mr1 avalon
set_connection_parameter_value fpga_mem_inst_mr1_bfm.m0/fpga_mem_inst.mr1 baseAddress 0x0000
add_connection fpga_mem_inst_mr2_bfm.m0 fpga_mem_inst.mr2 avalon
set_connection_parameter_value fpga_mem_inst_mr2_bfm.m0/fpga_mem_inst.mr2 baseAddress 0x0000
add_connection fpga_mem_inst_mr3_bfm.m0 fpga_mem_inst.mr3 avalon
set_connection_parameter_value fpga_mem_inst_mr3_bfm.m0/fpga_mem_inst.mr3 baseAddress 0x0000
add_connection fpga_mem_inst_mrx_bfm.m0 fpga_mem_inst.mrx avalon
set_connection_parameter_value fpga_mem_inst_mrx_bfm.m0/fpga_mem_inst.mrx baseAddress 0x0000
add_connection fpga_mem_inst_mw0_bfm.m0 fpga_mem_inst.mw0 avalon
set_connection_parameter_value fpga_mem_inst_mw0_bfm.m0/fpga_mem_inst.mw0 baseAddress 0x0000
add_connection fpga_mem_inst_mw1_bfm.m0 fpga_mem_inst.mw1 avalon
set_connection_parameter_value fpga_mem_inst_mw1_bfm.m0/fpga_mem_inst.mw1 baseAddress 0x0000
add_connection fpga_mem_inst_mw2_bfm.m0 fpga_mem_inst.mw2 avalon
set_connection_parameter_value fpga_mem_inst_mw2_bfm.m0/fpga_mem_inst.mw2 baseAddress 0x0000
add_connection fpga_mem_inst_mw3_bfm.m0 fpga_mem_inst.mw3 avalon
set_connection_parameter_value fpga_mem_inst_mw3_bfm.m0/fpga_mem_inst.mw3 baseAddress 0x0000
add_connection fpga_mem_inst_mwa_bfm.m0 fpga_mem_inst.mwa avalon
set_connection_parameter_value fpga_mem_inst_mwa_bfm.m0/fpga_mem_inst.mwa baseAddress 0x0000
add_connection fpga_mem_inst_mwx_bfm.m0 fpga_mem_inst.mwx avalon
set_connection_parameter_value fpga_mem_inst_mwx_bfm.m0/fpga_mem_inst.mwx baseAddress 0x0000
add_connection fpga_mem_inst_mem_if_ddr3_emif_0_pll_sharing_bfm.conduit fpga_mem_inst.mem_if_ddr3_emif_0_pll_sharing conduit
add_connection fpga_mem_inst_mem_if_ddr3_emif_0_status_bfm.conduit fpga_mem_inst.mem_if_ddr3_emif_0_status conduit
add_connection fpga_mem_inst_oct_bfm.conduit fpga_mem_inst.oct conduit
add_connection mem_if_ddr3_emif_0_mem_model.memory fpga_mem_inst.memory_0 conduit

set_interconnect_requirement {$system} qsys_mm.clockCrossingAdapter HANDSHAKE
set_interconnect_requirement {$system} qsys_mm.maxAdditionalLatency 1
set_interconnect_requirement {$system} qsys_mm.insertDefaultSlave false

save_system fpga_mem_tb.qsys
